# EAGLE design controller-batpack (EAGLE 8.4.1)
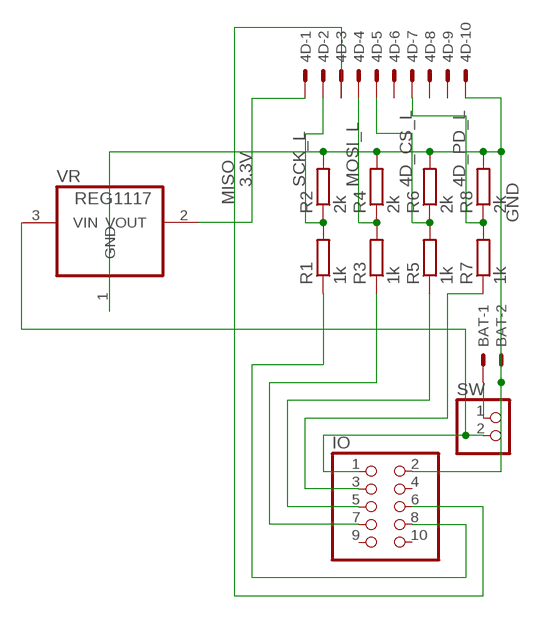
[diagram p0: schematic, sheet 1]

## Parts
4D  52745-1090  [52745-1090]
BAT  22-23-2021  [22-23-2021]
IO  PINHD-2X5/90  [2X05/90]
R1  1k  R-EU_M1206  [M1206]
R2  2k  R-EU_M1206  [M1206]
R3  1k  R-EU_M1206  [M1206]
R4  2k  R-EU_M1206  [M1206]
R5  1k  R-EU_M1206  [M1206]
R6  2k  R-EU_M1206  [M1206]
R7  1k  R-EU_M1206  [M1206]
R8  2k  R-EU_M1206  [M1206]
SW  PINHD-1X2/90  [1X02/90]
VR  REG1117  [SOT223]

## Nets
3.3V: 4D.1 VR.2(VOUT)
4D_CS: IO.5 R5.1
4D_CS_L: 4D.5 R5.2 R6.1
4D_PD: IO.3 R7.1
4D_PD_L: 4D.7 R7.2 R8.1
5V: IO.1 SW.2 VR.3(VIN)
5V2: BAT.1 SW.1
GND: 4D.10 BAT.2 IO.2 R2.2 R4.2 R6.2 R8.2 VR.1(GND)
MISO: 4D.3 IO.6
MOSI: IO.7 R3.1
MOSI_L: 4D.4 R3.2 R4.1
SCK: IO.8 R1.1
SCK_L: 4D.2 R1.2 R2.1
Unconnected: 4D.6 4D.8 4D.9 IO.4 IO.9 IO.10

## Library data of the parts
4D = con-molex:52745-1090: FFC/FPC-to-Board 0.50mm (.020") SMT Top Contact Right Angle, ZIF, Style Receptacle 52745 / 52435 Source: http://www.molex.com/product/ffc/52745.html; MPN: 52745-1090; OC_FARNELL: unknown; OC_NEWARK: 92M6380
BAT = con-molex:22-23-2021: .100" (2.54mm) Center Header - 2 Pin; MF: MOLEX; MPN: 22-23-2021; OC_FARNELL: 1462926; OC_NEWARK: 25C3832
IO = pinhead:PINHD-2X5: PIN HEADER
R1-R8 = rcl:R-EU_: RESISTOR, European symbol
SW = pinhead:PINHD-1X2: PIN HEADER
VR = burr-brown:REG1117: 800mA and 1A Low Dropout (LDO) Positive Regulator 1.8V, 2.5V, 2.85V, 3.3V, 5V, and Adj; MPN: REG1117; OC_FARNELL: 1097566; OC_NEWARK: 14P6981

## Board
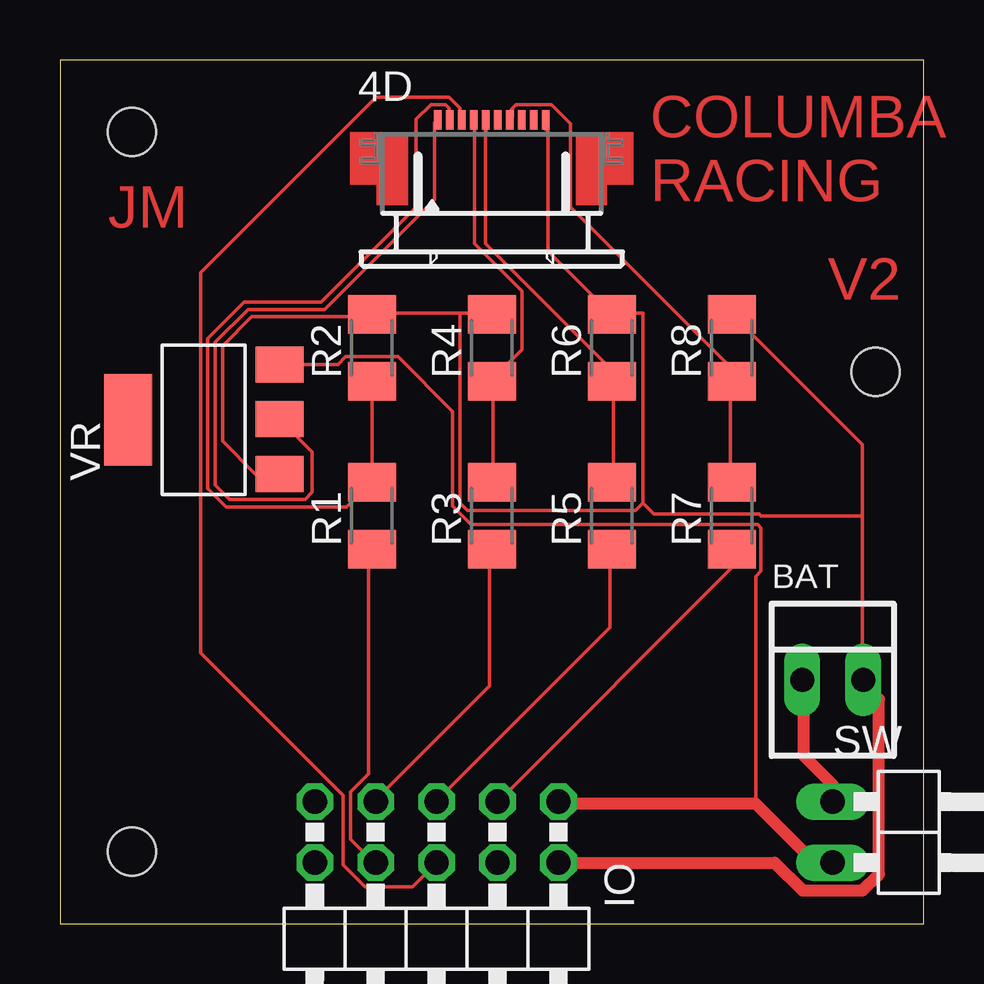
[diagram p1: board, top side]

Size 36 x 36 mm. Coordinates in mm from the lower left corner, seen from the top.
Outline: 0,0 36,0 36,36 0,36 0,0
Copper layers (1*16): Top 0.035mm / dielectric 1.5mm / Bottom 0.035mm
Design rules "default": minimum track width 6mil, minimum drill 0.35mm, track to track 6mil, track to pad 6mil, pad to pad 6mil, via to via 6mil, smd to smd 6mil, copper to edge 40mil, drill to drill 6mil, minimum pad ring 10mil, minimum via ring 8mil, stop-mask expansion 4mil, vias tented up to drill 0mil, thermal gap 10mil
Holes 2 mm at 34,23 3,33 3,3

### Footprints (pad centres in the part's own frame; a part is rotated, then mirrored left to right if it is on the bottom)
52745-1090 = smd 0.3 x 0.8: 1 -2.25,2.5; 2 -1.75,2.5; 3 -1.25,2.5; 4 -0.75,2.5; 5 -0.25,2.5; 6 0.25,2.5; 7 0.75,2.5; 8 1.25,2.5; 9 1.75,2.5; 10 2.25,2.5
22-23-2021 = drill 1 long: 1 -1.27,0; 2 1.27,0
2X05/90 = drill 1.016 octagon: 1 -5.08,-6.35; 2 -5.08,-3.81; 3 -2.54,-6.35; 4 -2.54,-3.81; 5 0,-6.35; 6 0,-3.81; 7 2.54,-6.35; 8 2.54,-3.81; 9 5.08,-6.35; 10 5.08,-3.81
M1206 = smd 1.6 x 2: 1 -1.4,0; 2 1.4,0
1X02/90 = drill 1.016 long: 1 -1.27,-3.81; 2 1.27,-3.81
SOT223 = smd 1.499 x 2.007: 1 -2.261,-3.15; 2 0.025,-3.15; 3 2.311,-3.15 | smd 3.81 x 2.007: 4 0,3.15

### Placement (x,y rotation side)
4D  18,31 0 top
BAT  32.21,10.16 0 top
IO  15.7,-1.27 180 top
R1  13,17 90 top
R2  13,24 90 top
R3  18,17 90 top
R4  18,24 90 top
R5  23,17 90 top
R6  23,24 90 top
R7  28,17 90 top
R8  28,24 90 top
SW  36.02,3.81 270 top
VR  6,21 90 top

### Tracks (layer width: path | path; a pad name or v marks a point on that pad's centre or on a via)
3.3V
  Top 0.152: 15.61,33.36 15.61,30.18 11.04,25.6 7.84,25.6 6.47,24.23 6.47,18.29 7.08,17.68 10.21,17.68 10.52,17.98 10.52,19.66 9.3,20.88 VR.2 | 15.61,33.36 15.61,33.38 | 15.61,33.36 4D.1
4D_CS
  Top 0.152: R5.1 22.93,15.54 22.93,12.34 15.76,5.18 IO.5
4D_CS_L
  Top 0.152: 17.75,33 17.75,28.35 22.93,23.16 22.93,22.71 R6.1 23.08,22.55 23.08,18.44 R5.2 | 17.75,33 17.75,33.38 | 4D.5 17.75,33.01 17.75,33
4D_PD
  Top 0.152: R7.1 27.96,15.54 27.96,14.78 18.36,5.18 IO.3
4D_PD_L
  Top 0.152: R7.2 27.96,18.44 27.96,22.55 R8.1 28,23.13 21.27,29.86 21.27,33.34 21.25,33.37 20.5,34.13 19,34.13 18.87,33.99 | 18.87,33.62 18.87,33.99 | 4D.7 18.75,33.87 18.87,33.99
5V
  Top 0.152: VR.3 11.59,23.31 11.9,23.63 14.1,23.63 16.37,21.35 16.37,17.4 17.14,16.63 29.09,16.63 29.23,16.5 29.23,14.71 29,14.48 29,5
  Top 0.5: IO.1 20.86,5 29,5 31.46,2.54 SW.2
5V2
  Top 0.5: SW.1 32.21,5.79 31,7 31,10.1 BAT.1
GND
  Top 0.152: 16.68,25.45 17.9,25.45 R4.2 | 16.68,25.45 13.02,25.45 R2.2 12.87,25.3 7.99,25.3 6.77,24.08 6.77,20.12 8.14,18.75 VR.1 | 20.34,33 20.34,28.04 22.93,25.45 R6.2 23.08,25.45 24.3,25.45 24.3,17.53 | 20.34,33 20.34,33.38 | 27.96,25.45 R8.2 28.11,25.3 33.44,19.96 33.44,17 | 33.44,17 33.44,10.21 BAT.2 | 20.79,2.44 IO.2 | 16.68,25.45 16.68,17.53 16.98,17.22 23.99,17.22 24.3,17.53 | 24.3,17.53 24.76,17.07 29.15,17.07 29.22,17 33.44,17 | 4D.10 20.25,33.09 20.34,33
  Top 0.5: IO.2 29.8,2.54 30.97,1.38 33.45,1.38 34.14,2.06 34.14,9.35 33.44,10.05 33.44,10.21
MISO
  Top 0.152: 4D.3 16.68,33.53 16.68,33.98 16.22,34.44 13.17,34.44 5.86,27.13 5.86,11.28 11.8,5.33 11.8,2.44 12.72,1.52 14.7,1.52 15.61,2.44 IO.6
MOSI
  Top 0.152: R3.1 17.9,15.54 17.9,9.91 13.17,5.18 IO.7
MOSI_L
  Top 0.152: 4D.4 17.29,33.38 17.29,28.35 19.27,26.36 19.27,23.93 18.05,22.71 R4.1 18.05,22.55 18.05,18.44 R3.2
SCK
  Top 0.152: R1.1 12.87,15.54 12.87,6.25 12.11,5.49 12.11,3.5 13.02,2.59 IO.8
SCK_L
  Top 0.152: 16.22,33.98 16.22,33.53 | 16.22,33.98 16.07,34.14 15.46,34.14 14.85,33.53 14.85,29.87 10.89,25.91 7.69,25.91 6.16,24.38 6.16,18.14 6.92,17.37 11.95,17.37 12.87,18.29 R1.2 13.02,18.44 13.02,22.55 R2.1 | 4D.2 16.22,33.53 16.22,33.98

### Text on the board
Top: COLUMBA / RACING | JM | V2